# Altium schematic sheet temperature_m.SchDoc
size A4
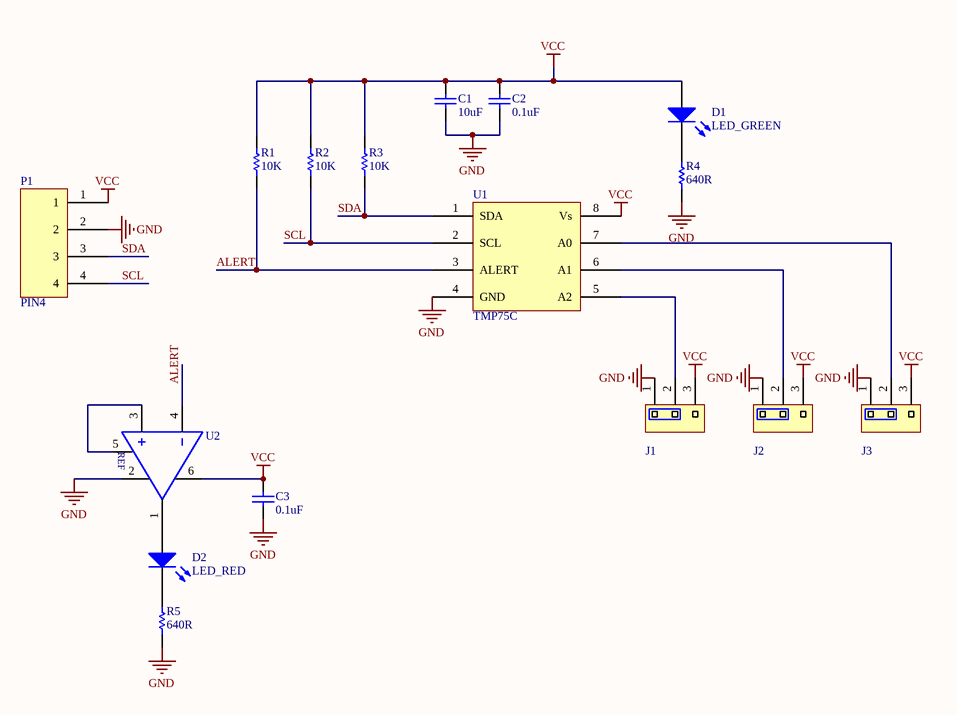
[diagram p0: temperature_m.SchDoc]

## Parts
C1  value 10uF  [CAP0805]  (hidden comment: CAP)
C2  value 0.1uF  [CAP0805]  (hidden comment: CAP)
C3  value 0.1uF  [CAP0805]  (hidden comment: CAP)
D1  LED_GREEN  [LED0805]
D2  LED_RED  [LED0805]
J1  J Jumper_COM_L  [PIN3]  (value not drawn)
J2  J Jumper_COM_L  [PIN3]  (value not drawn)
J3  J Jumper_COM_L  [PIN3]  (value not drawn)
P1  PIN4  [PIN4]
R1  value 10K  [RES0805]  (hidden comment: RES)
R2  value 10K  [RES0805]  (hidden comment: RES)
R3  value 10K  [RES0805]  (hidden comment: RES)
R4  value 640R  [RES0805]  (hidden comment: RES)
R5  value 640R  [RES0805]  (hidden comment: RES)
U1  TMP75C  [SOIC8]
U2  CMP  SOT23  [SOT23-6]  (value not drawn)

## Nets
GND: C1.1 C2.1 C3.1 J1.1 J2.1 J3.1 P1.2 R4.1 R5.1 U1.4(GND) U2.2(V-)
VCC: C1.2 C2.2 C3.2 D1.1(A) J1.3 J2.3 J3.3 P1.1 R1.2 R2.2 R3.2 U1.8(Vs) U2.6(V+)
ALERT: R1.1 U1.3(ALERT) U2.4(IN-)
SCL: P1.4 R2.1 U1.2(SCL)
SDA: P1.3 R3.1 U1.1(SDA)
NetD1_2: D1.2(K) R4.2
NetD2_1: D2.1(A) U2.1(Out)
NetD2_2: D2.2(K) R5.2
NetJ1_2: J1.2 U1.5(A2)
NetJ2_2: J2.2 U1.6(A1)
NetJ3_2: J3.2 U1.7(A0)
NetU2_3: U2.3(IN+) U2.5(Ref)

## Notes on the sheet
- (in symbol CMP SOT23) REF

## Library data of the parts
C1-C3 = CAP1
D1 D2 = LED
R1-R5 = RES1
U1 = TMP75C: Digital temperature sensor chip, The lowest power supply 1.8v, Operation temp: -55 to 125; Company: TI
U2 = CMP SOT23: Comparator with Voltage Reference; Company: TI